# EAGLE design EN715 (EAGLE 9.6.2)
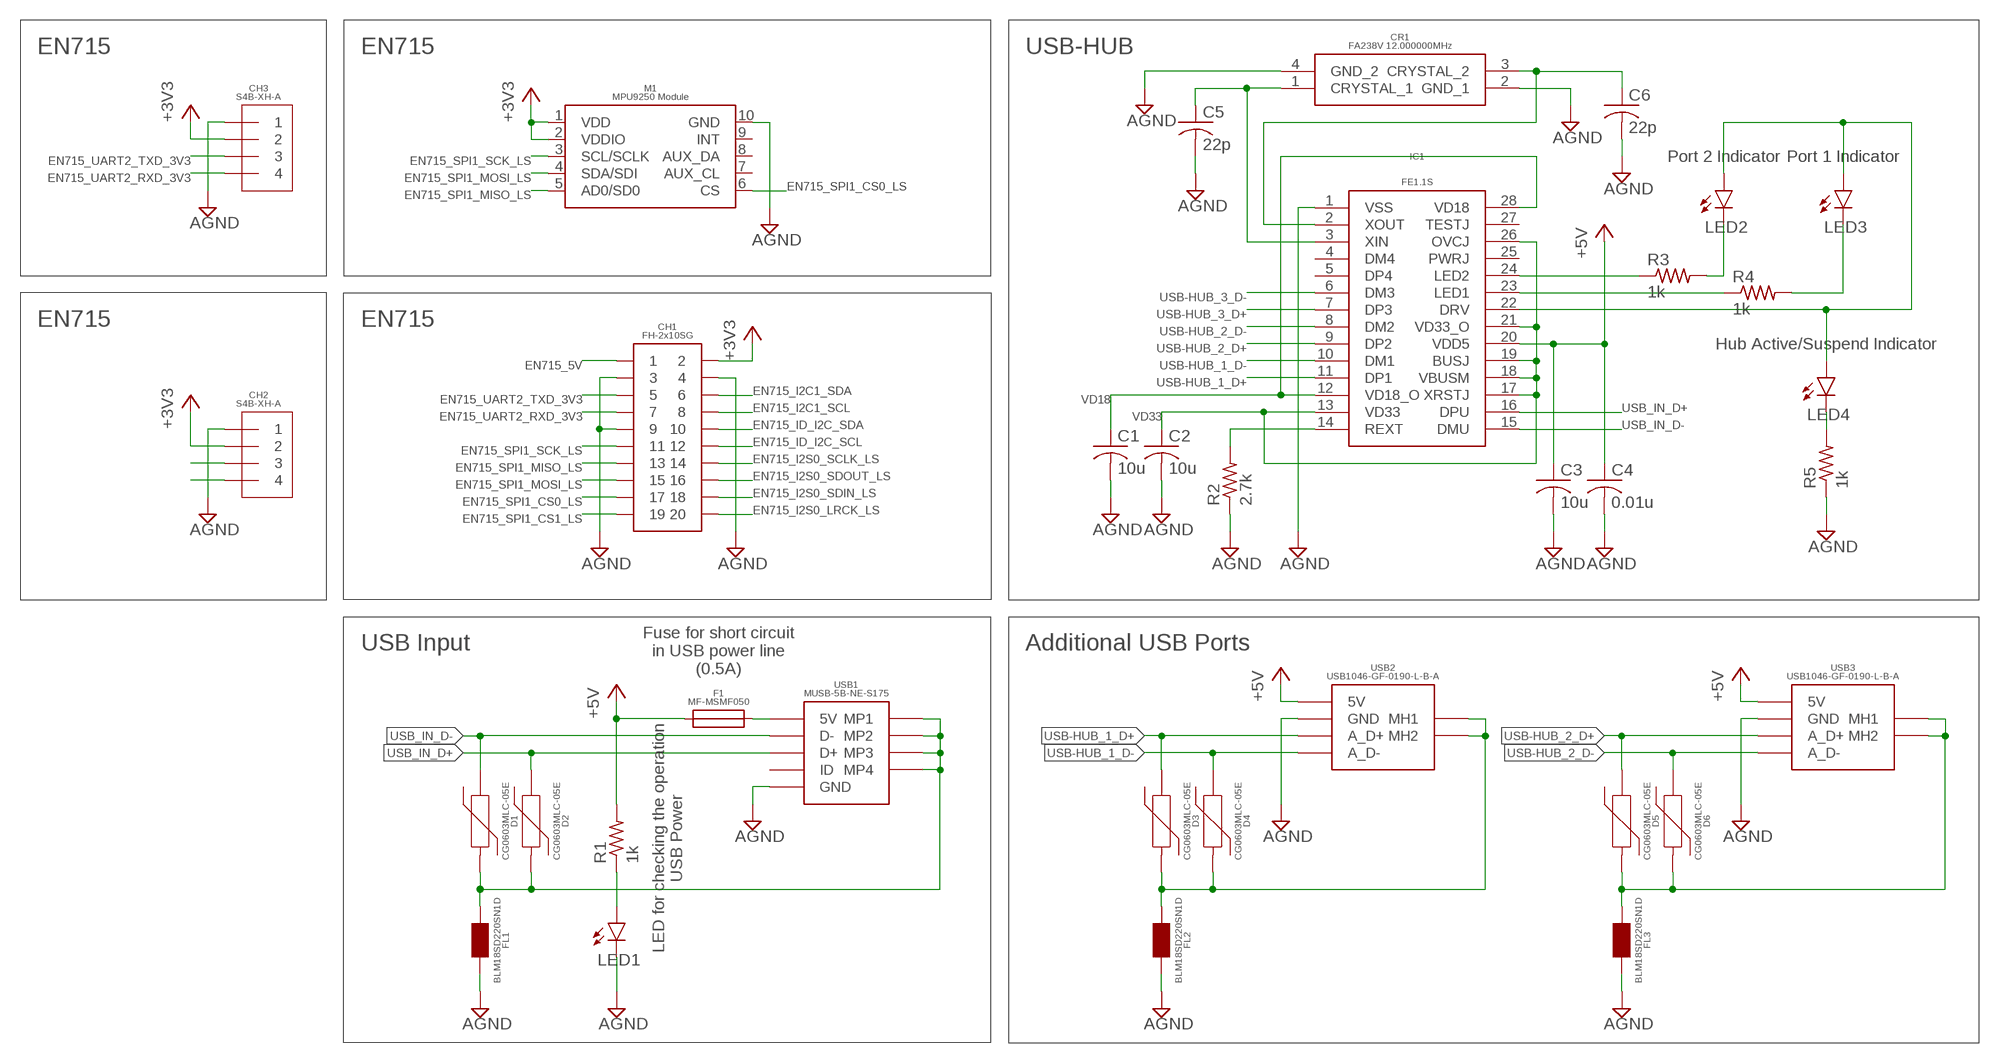
[diagram p0: schematic, sheet 1]

## Parts
C1  10u  C-USC0603  [C0603]
C2  10u  C-USC0603  [C0603]
C3  10u  C-USC0603  [C0603]
C4  0.01u  C-USC0603  [C0603]
C5  22p  C-USC0603  [C0603]
C6  22p  C-USC0603  [C0603]
CH1  2X10  [2X10]
CH2  S4B-XH-A  [S4B-XH-A]
CH3  S4B-XH-A  [S4B-XH-A]
CR1  FA238V_12.000000MHZ  [FA238V]
D1  CG0603MLC-05E  [CG0603MLC-05E]
D2  CG0603MLC-05E  [CG0603MLC-05E]
D3  CG0603MLC-05E  [CG0603MLC-05E]
D4  CG0603MLC-05E  [CG0603MLC-05E]
D5  CG0603MLC-05E  [CG0603MLC-05E]
D6  CG0603MLC-05E  [CG0603MLC-05E]
F1  MF-MSMF050  [MF-MSMF050]
FL1  BLM18SD220SN1D  [BLM18SD220SN1D]
FL2  BLM18SD220SN1D  [BLM18SD220SN1D]
FL3  BLM18SD220SN1D  [BLM18SD220SN1D]
IC1  FE1.1S  [FE1.1S]
LED1  LEDSML0603  [SML0603]
LED2  LEDSML0603  [SML0603]
LED3  LEDSML0603  [SML0603]
LED4  LEDSML0603  [SML0603]
M1  MPU9250_MODULE  [MPU9250_MODULE]
R1  1k  R-US_R0603  [R0603]
R2  2.7k  R-US_R0603  [R0603]
R3  1k  R-US_R0603  [R0603]
R4  1k  R-US_R0603  [R0603]
R5  1k  R-US_R0603  [R0603]
USB1  MINI_USB_B_SMD  [MINI_USB_B_SMD]
USB2  USB_A_X1_SMD  [USB_A_X1_SMD]
USB3  USB_A_X1_SMD  [USB_A_X1_SMD]

## Nets
+3V3 [USB-Power]: CH1.2 CH2.2 CH3.2 M1.1(VDD) M1.2(VDDIO)
+5V [USB-Power]: C3.1 C4.1 F1.1 IC1.20(VDD5) R1.2 USB2.1(5V) USB3.1(5V)
AGND [USB-Power]: C1.2 C2.2 C3.2 C4.2 C5.2 C6.2 CH1.3 CH1.4 CH1.9 CH2.1 CH3.1 CR1.2(GND_1) CR1.4(GND_2) FL1.2 FL2.2 FL3.2 IC1.1(VSS) LED1.C M1.10(GND) R2.1 R5.1 USB1.5(GND) USB2.4(GND) USB3.4(GND)
B_FUSE_USB_MINI_B [USB-Power]: F1.2 USB1.1(5V)
EN715_5V [USB-Power]: CH1.1
EN715_I2C1_SCL [USB-Data]: CH1.8
EN715_I2C1_SDA [USB-Data]: CH1.6
EN715_I2S0_LRCK_LS [USB-Data]: CH1.20
EN715_I2S0_SCLK_LS [USB-Data]: CH1.14
EN715_I2S0_SDIN_LS [USB-Data]: CH1.18
EN715_I2S0_SDOUT_LS [USB-Data]: CH1.16
EN715_ID_I2C_SCL [USB-Data]: CH1.12
EN715_ID_I2C_SDA [USB-Data]: CH1.10
EN715_SPI1_CS0_LS [USB-Data]: CH1.17 M1.6(CS)
EN715_SPI1_CS1_LS [USB-Data]: CH1.19
EN715_SPI1_MISO_LS [USB-Data]: CH1.13 M1.5(AD0/SD0)
EN715_SPI1_MOSI_LS [USB-Data]: CH1.15 M1.4(SDA/SDI)
EN715_SPI1_SCK_LS [USB-Data]: CH1.11 M1.3(SCL/SCLK)
EN715_UART2_RXD_3V3 [USB-Data]: CH1.7 CH3.4
EN715_UART2_TXD_3V3 [USB-Data]: CH1.5 CH3.3
FE1.1S_DRV [USB-Power]: IC1.22(DRV) LED2.A LED3.A LED4.A
FE1.1S_DRV_LED_A [USB-Power]: LED4.C R5.2
FE1.1S_LED1_A [USB-Power]: LED3.C R4.2
FE1.1S_LED_1_B [USB-Power]: IC1.23(LED1) R4.1
FE1.1S_LED_2_A [USB-Power]: LED2.C R3.2
FE1.1S_LED_2_B [USB-Power]: IC1.24(LED2) R3.1
LED_USBIN [USB-Power]: LED1.A R1.1
N$1: CH2.3
N$2: CH2.4
REXT_FE1.1S [USB-Data]: IC1.14(REXT) R2.2
USB-HUB_1_D+ [USB-Data]: D3.1 IC1.11(DP1) USB2.3(A_D+)
USB-HUB_1_D- [USB-Data]: D4.1 IC1.10(DM1) USB2.2(A_D-)
USB-HUB_2_D+ [USB-Data]: D5.1 IC1.9(DP2) USB3.3(A_D+)
USB-HUB_2_D- [USB-Data]: D6.1 IC1.8(DM2) USB3.2(A_D-)
USB-HUB_3_D+ [USB-Data]: IC1.7(DP3)
USB-HUB_3_D- [USB-Data]: IC1.6(DM3)
USB_A_1_SHIELD [USB-Power]: D3.2 D4.2 FL2.1 USB2.MH1 USB2.MH2
USB_A_2_SHIELD [USB-Power]: D5.2 D6.2 FL3.1 USB3.MH1 USB3.MH2
USB_IN_D+ [USB-Data]: D2.1 IC1.16(DPU) USB1.3(D+)
USB_IN_D- [USB-Data]: D1.1 IC1.15(DMU) USB1.2(D-)
USB_MINI_B_SHIELD [USB-Power]: D1.2 D2.2 FL1.1 USB1.MP1 USB1.MP2 USB1.MP3 USB1.MP4
VD18 [USB-Power]: C1.1 IC1.12(VD18_O) IC1.28(VD18)
VD33 [USB-Power]: C2.1 IC1.13(VD33) IC1.17(XRSTJ) IC1.18(VBUSM) IC1.19(BUSJ) IC1.21(VD33_O) IC1.26(OVCJ)
XIN_FE1.1S [USB-Data]: C5.1 CR1.1(CRYSTAL_1) IC1.3(XIN)
XOUT_FE1.1S [USB-Data]: C6.1 CR1.3(CRYSTAL_2) IC1.2(XOUT)
Unconnected: IC1.4(DM4) IC1.5(DP4) IC1.25(PWRJ) IC1.27(TESTJ) M1.7(AUX_CL) M1.8(AUX_DA) M1.9(INT) USB1.4(ID)

## Notes on the sheet
- EN715 | EN715 | USB-HUB
- Port 2 Indicator | Port 1 Indicator
- EN715 | EN715
- Hub Active/Suspend Indicator
- USB Input | Additional USB Ports
- Fuse for short circuit
  in USB power line
  (0.5A)
- LED for checking the operation
  USB Power

## Library data of the parts
C1-C6 = rcl:C-US: CAPACITOR, American symbol; SPICEPREFIX: C
CH1 = Pin_socket:2X10
CH2 CH3 = JST-XH:S4B-XH-A
CR1 = FA238V:FA238V_12.000000MHZ
D1-D6 = CG0603MLC-05E:CG0603MLC-05E
F1 = MF-MSMF:MF-MSMF050
FL1-FL3 = BLM18SD220SN1D:BLM18SD220SN1D
IC1 = FE1.1S:FE1.1S
LED1-LED4 = led:LED: LED OSRAM: - CHIPLED LG R971, LG N971, LY N971, LG Q971, LY Q971, LO R971, LY R971 LH N974, LH R974 LS Q976, LO Q976, LY Q976 LO Q996 - Hyper CHIPLED LW Q18S LB Q993, LB Q99A, LB R99A - SideLED LS A670, LO A670, LY A670, LG A670, LP A670 LB A673, LV A673, LT A673, LW A673 LH A674 LY A675 LS A676, LA A676, LO A676, LY A676, LW A676 LS A679, LY A679, LG A679 - Hyper Micro SIDELED® LS Y876, LA Y876, LO Y876, LY Y876 LT Y87S - SmartLED LW L88C, LW L88S LB L89C, LB L89S, LG L890 LS L89K, LO L89K, LY L89K LS L896, LA L896, LO L896, LY L896 - TOPLED LS T670, LO T670, LY T670, LG T670, LP T670 LSG T670, LSP T670, LSY T670, LOP T670, LYG T670 LG T671, LOG T671, LSG T671 LB T673, LV T673, LT T673, LW T673 LH T674 LS T676, LA T676, LO T676, LY T676, LB T676, LH T676, LSB T676, LW T676 LB T67C, LV T67C, LT T67C, LS T67K, LO T67K, LY T67K, LW E67C LS E67B, LA E67B, LO E67B, LY E67B, LB E67C, LV E67C, LT E67C LW T67C LS T679, LY T679, LG T679 LS T770, LO T770, LY T770, LG T770, LP T770 LB T773, LV T773, LT T773, LW T773 LH T774 LS E675, LA E675, LY E675, LS T675 LS T776, LA T776, LO T776, LY T776, LB T776 LHGB T686 LT T68C, LB T68C - Hyper Mini TOPLED® LB M676 - Mini TOPLED Santana® LG M470 LS M47K, LO M47K, LY M47K Source: http://www.osram.convergy.de LUXEON: - LUMILED® LXK2-PW12-R00, LXK2-PW12-S00, LXK2-PW14-U00, LXK2-PW14-V00 LXK2-PM12-R00, LXK2-PM12-S00, LXK2-PM14-U00 LXK2-PE12-Q00, LXK2-PE12-R00, LXK2-PE12-S00, LXK2-PE14-T00, LXK2-PE14-U00 LXK2-PB12-K00, LXK2-PB12-L00, LXK2-PB12-M00, LXK2-PB14-N00, LXK2-PB14-P00, LXK2-PB14-Q00 LXK2-PR12-L00, LXK2-PR12-M00, LXK2-PR14-Q00, LXK2-PR14-R00 LXK2-PD12-Q00, LXK2-PD12-R00, LXK2-PD12-S00 LXK2-PH12-R00, LXK2-PH12-S00 LXK2-PL12-P00, LXK2-PL12-Q00, LXK2-PL12-R00 Source: www.luxeon.com KINGBRIGHT: KA-3528ASYC Source: www.kingbright.com
M1 = Strawberry-Linux_MPUP250_Module:MPU9250_MODULE
R1-R5 = rcl:R-US_: RESISTOR, American symbol; SPICEPREFIX: R
USB1 = USB_Connector:MINI_USB_B_SMD
USB2 USB3 = USB_Connector:USB_A_X1_SMD

## Net classes
1 USB-Data: width 0.203 mm, drill 0.127 mm, clearance 0.203 mm
2 USB-Power: width 0.254 mm, drill 0.127 mm, clearance 0.203 mm

## Board
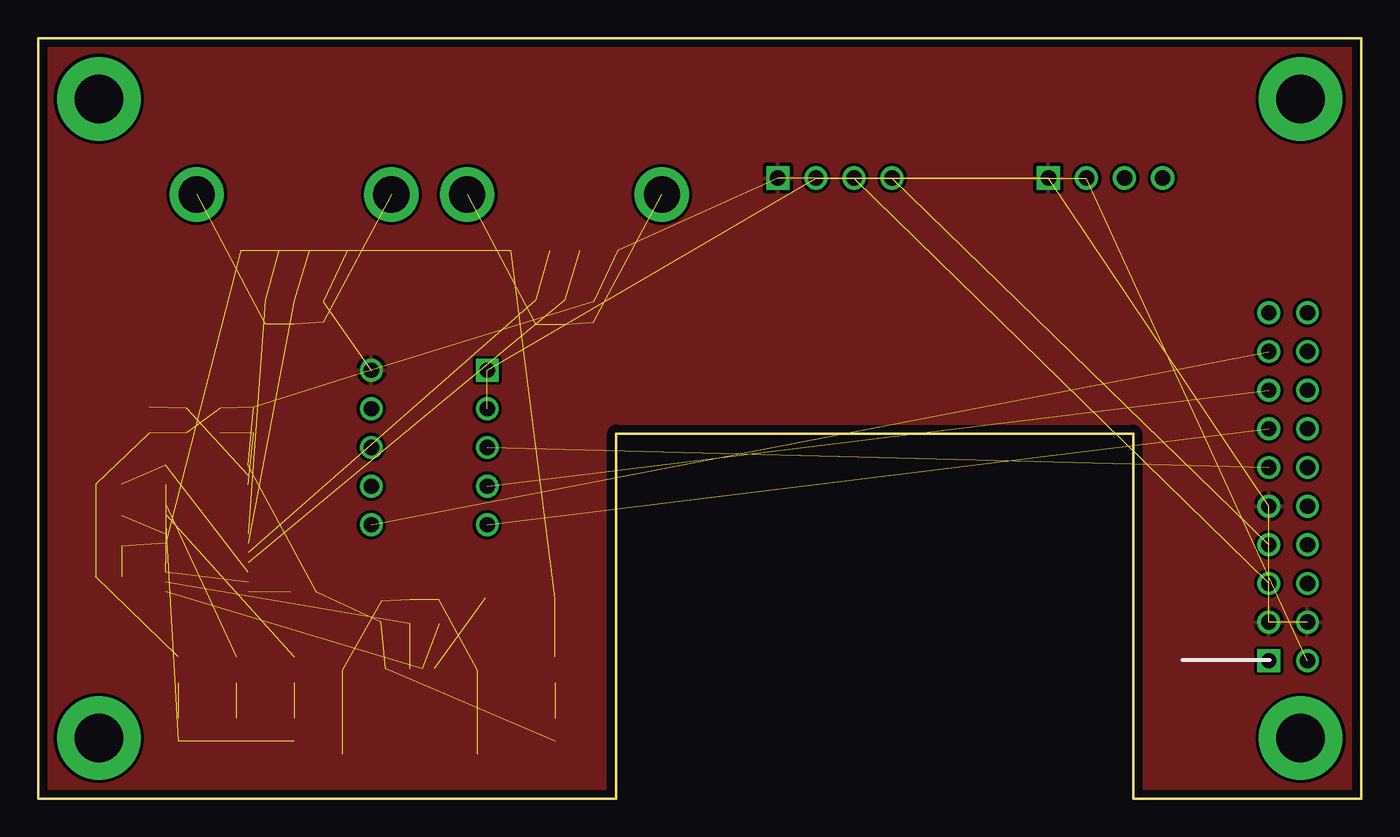
[diagram p1: board, top side]
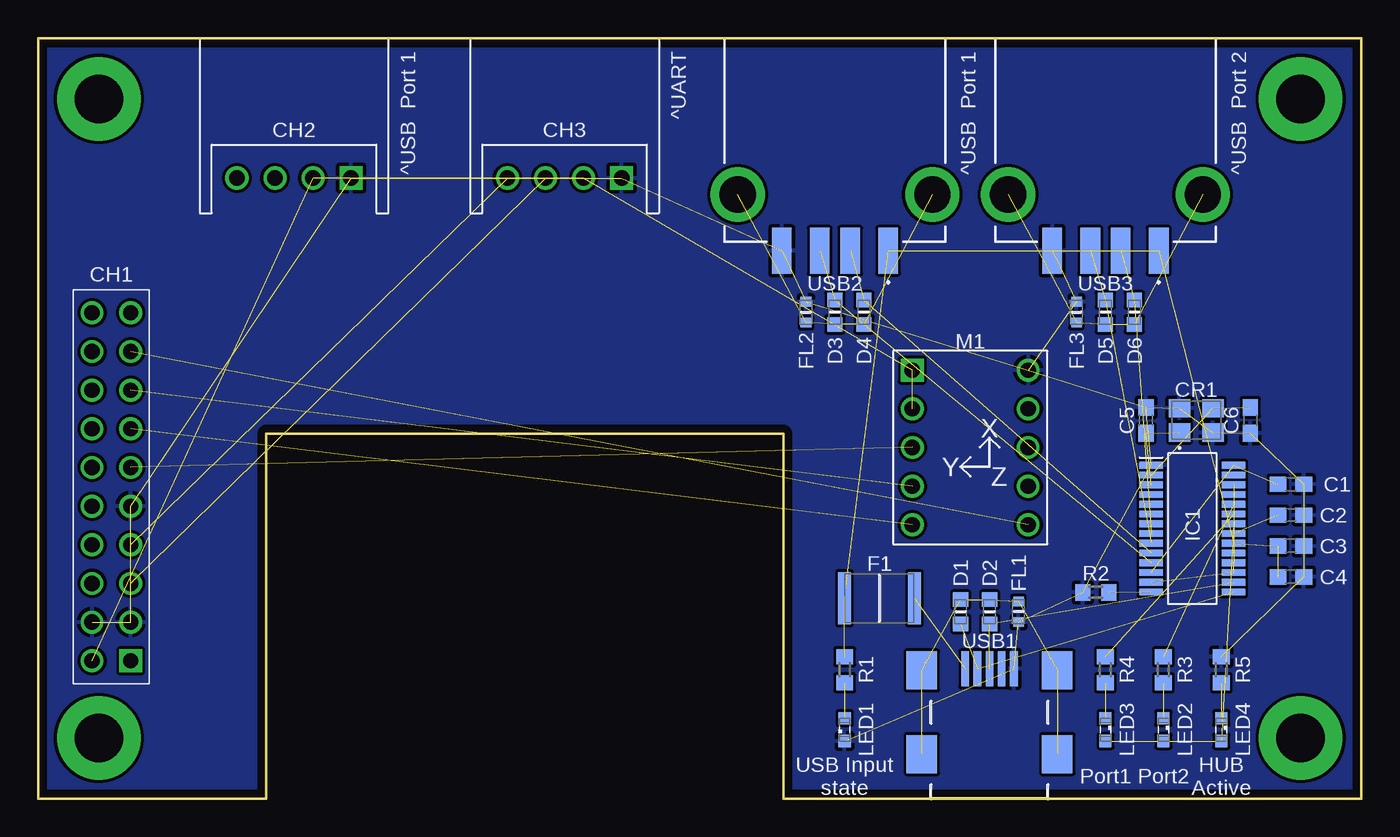
[diagram p2: board, bottom side, seen from below]

Size 87 x 50 mm. Coordinates in mm from the lower left corner, seen from the top.
Outline: 0,50 0,0 38,0 38,24 72,24 72,0 87,0 87,50 0,50
Copper layers (1*16): Top 0.035mm / dielectric 1.6mm / Bottom 0.035mm
Design rules "Elecrow_2-layer_PCB_eagle_rule": minimum track width 6mil, minimum drill 12mil, track to track 6mil, track to pad 6mil, pad to pad 6mil, via to via 8mil, smd to smd 0mil, copper to edge 20mil, drill to drill 10mil, minimum pad ring 6mil, minimum via ring 6mil, stop-mask expansion 0mil, vias tented up to drill 100mil, thermal gap 10mil

### Footprints (pad centres in the part's own frame; a part is rotated, then mirrored left to right if it is on the bottom)
C0603 = smd 1.1 x 1: 1 -0.85,0; 2 0.85,0
2X10 = drill 1 pad 1.5 square: 1 -11.43,-1.27 | drill 1 pad 1.5: 2 -11.43,1.27; 3 -8.89,-1.27; 4 -8.89,1.27; 5 -6.35,-1.27; 6 -6.35,1.27; 7 -3.81,-1.27; 8 -3.81,1.27; 9 -1.27,-1.27; 10 -1.27,1.27; 11 1.27,-1.27; 12 1.27,1.27; 13 3.81,-1.27; 14 3.81,1.27; 15 6.35,-1.27; 16 6.35,1.27; 17 8.89,-1.27; 18 8.89,1.27; 19 11.43,-1.27; 20 11.43,1.27
S4B-XH-A = drill 1.016 square: 1 3.75,0 | drill 1.016: 2 1.25,0; 3 -1.25,0; 4 -3.75,0
FA238V = smd 1.4 x 1.2: 1 -1.1,-0.8; 2 1.1,-0.8; 3 1.1,0.8; 4 -1.1,0.8
CG0603MLC-05E = smd 0.95 x 1: 1 -0.8,0; 2 0.8,0
MF-MSMF050 = smd 0.85 x 3.43: 1 -2.3,0; 2 2.3,0
BLM18SD220SN1D = smd 0.65 x 0.7: 1 -0.675,0; 2 0.675,0
FE1.1S = smd 1.525 x 0.44: 1 -2.712,4.16; 2 -2.712,3.52; 3 -2.712,2.88; 4 -2.712,2.24; 5 -2.712,1.6; 6 -2.712,0.96; 7 -2.712,0.32; 8 -2.712,-0.32; 9 -2.712,-0.96; 10 -2.712,-1.6; 11 -2.712,-2.24; 12 -2.712,-2.88; 13 -2.712,-3.52; 14 -2.712,-4.16; 15 2.712,-4.16; 16 2.712,-3.52; 17 2.712,-2.88; 18 2.712,-2.24; 19 2.712,-1.6; 20 2.712,-0.96; 21 2.712,-0.32; 22 2.712,0.32; 23 2.712,0.96; 24 2.712,1.6; 25 2.712,2.24; 26 2.712,2.88; 27 2.712,3.52; 28 2.712,4.16
SML0603 = smd 0.8 x 0.8: A 0.75,0; C -0.75,0
MPU9250_MODULE = drill 1 square: 1 -5.08,-3.81 | drill 1: 2 -2.54,-3.81; 3 0,-3.81; 4 2.54,-3.81; 5 5.08,-3.81; 6 5.08,3.81; 7 2.54,3.81; 8 0,3.81; 9 -2.54,3.81; 10 -5.08,3.81
R0603 = smd 1 x 1.1: 1 -0.85,0; 2 0.85,0
MINI_USB_B_SMD = smd 0.5 x 2.3: 1 -1.6,8.55; 2 -0.8,8.55; 3 0,8.55; 4 0.8,8.55; 5 1.6,8.55 | smd 2 x 2.5: MP1 -4.45,8.45; MP2 4.45,8.45; MP3 4.45,2.95; MP4 -4.45,2.95
USB_A_X1_SMD = smd 1.3 x 3: 1 -3.5,13.98; 2 -1,13.98; 3 1,13.98; 4 3.5,13.98 | drill 2.38 pad 3.57: MH1 -6.4,10.28; MH2 6.4,10.28

### Placement (x,y rotation side)
C1  4.64,20.68 0 bottom
C2  4.64,18.65 0 bottom
C3  4.64,16.62 0 bottom
C4  4.64,14.59 0 bottom
C5  14.16,24.87 90 bottom
C6  7.3,24.87 270 bottom
CH1  82.18,20.51 90 bottom
CH2  70.17,40.8 0 bottom
CH3  52.39,40.8 0 bottom
CR1  10.86,24.87 0 bottom
D1  26.36,12.3 90 bottom
D2  24.45,12.3 90 bottom
D3  34.61,31.98 270 bottom
D4  32.7,31.98 270 bottom
D5  16.83,31.98 270 bottom
D6  14.93,31.98 270 bottom
F1  31.69,13.19 0 bottom
FL1  22.55,12.3 270 bottom
FL2  36.52,31.98 90 bottom
FL3  18.73,31.98 90 bottom
IC1  11.12,17.76 0 bottom
LED1  33.98,4.55 90 bottom
LED2  13.02,4.55 270 bottom
LED3  16.83,4.55 270 bottom
LED4  9.21,4.55 270 bottom
M1  25.72,23.09 270 bottom
R1  33.98,8.49 90 bottom
R2  17.46,13.57 0 bottom
R3  13.02,8.49 270 bottom
R4  16.83,8.49 270 bottom
R5  9.21,8.49 270 bottom
USB1  24.45,0 0 bottom
USB2  34.61,50 180 bottom
USB3  16.83,50 180 bottom

### Tracks (layer width: path | path; a pad name or v marks a point on that pad's centre or on a via)
+3V3  (4 unrouted)
+5V  (6 unrouted)
AGND  (23 unrouted)
  pour Top: -0.95,51.03 -0.95,-1.04 38.42,-1.04 38.42,23.09 71.44,23.09 71.44,-1.04 87.95,-1.04 87.95,51.03
  pour Bottom: -1.59,51.67 -1.59,-1.67 39.05,-1.67 39.05,22.46 70.81,22.46 70.81,-1.67 88.59,-1.67 88.59,51.67
B_FUSE_USB_MINI_B  (1 unrouted)
EN715_SPI1_CS0_LS  (1 unrouted)
EN715_SPI1_MISO_LS  (1 unrouted)
EN715_SPI1_MOSI_LS  (1 unrouted)
EN715_SPI1_SCK_LS  (1 unrouted)
EN715_UART2_RXD_3V3  (1 unrouted)
EN715_UART2_TXD_3V3  (1 unrouted)
FE1.1S_DRV  (3 unrouted)
FE1.1S_DRV_LED_A  (1 unrouted)
FE1.1S_LED1_A  (1 unrouted)
FE1.1S_LED_1_B  (1 unrouted)
FE1.1S_LED_2_A  (1 unrouted)
FE1.1S_LED_2_B  (1 unrouted)
LED_USBIN  (1 unrouted)
REXT_FE1.1S  (1 unrouted)
S$1  (via drill 3.2 pad 5.5)
  other vias: 4,46
S$2  (via drill 3.2 pad 5.5)
  other vias: 83,46
S$3  (via drill 3.2 pad 5.5)
  other vias: 83,4
S$4  (via drill 3.2 pad 5.5)
  other vias: 4,4
USB-HUB_1_D+  (2 unrouted)
USB-HUB_1_D-  (2 unrouted)
USB-HUB_2_D+  (2 unrouted)
USB-HUB_2_D-  (2 unrouted)
USB_A_1_SHIELD  (4 unrouted)
USB_A_2_SHIELD  (4 unrouted)
USB_IN_D+  (2 unrouted)
USB_IN_D-  (2 unrouted)
USB_MINI_B_SHIELD  (6 unrouted)
VD18  (2 unrouted)
VD33  (6 unrouted)
XIN_FE1.1S  (2 unrouted)
XOUT_FE1.1S  (2 unrouted)

### Text on the board
bPlace: ^USB Port 2 | ^USB Port 1 | ^UART | ^USB Port 1 | HUB / Active | Port2 | Port1 | USB Input / state